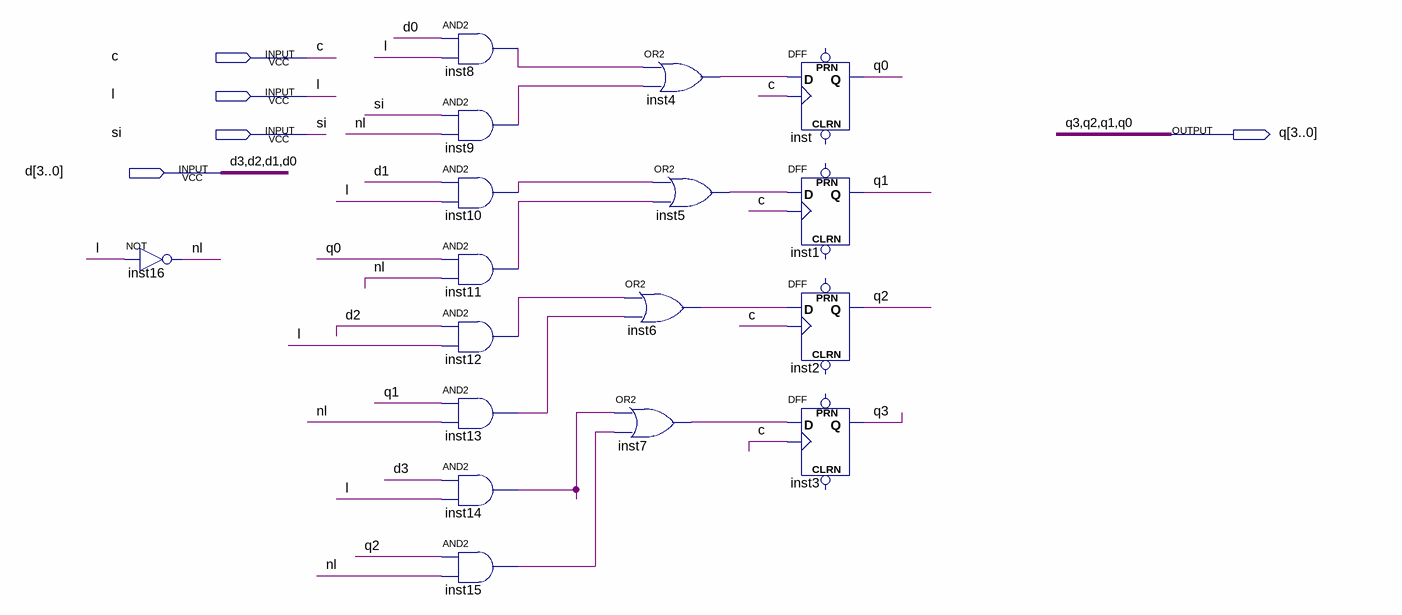
[diagram p0: schematic sheet]
// Quartus schematic s63.bdf as structural Verilog: 17 symbols, 5 pins
module s63 (
  input  c,
  input  l,
  input  si,
  input  [3:0] d,
  output [3:0] q
);

  wire inst4_out, inst5_out, inst6_out, inst7_out, inst8_out, inst9_out, inst10_out, inst11_out, inst12_out,
       inst13_out, inst14_out, inst15_out, nl;

  not inst16 (nl, l);
  and inst8 (inst8_out, d[0], l);
  and inst9 (inst9_out, si, nl);
  and inst10 (inst10_out, d[1], l);
  and inst11 (inst11_out, q[0], nl);
  and inst12 (inst12_out, d[2], l);
  and inst13 (inst13_out, q[1], nl);
  and inst14 (inst14_out, d[3], l);
  and inst15 (inst15_out, q[2], nl);
  or inst4 (inst4_out, inst8_out, inst9_out);
  or inst5 (inst5_out, inst10_out, inst11_out);
  or inst6 (inst6_out, inst12_out, inst13_out);
  or inst7 (inst7_out, inst14_out, inst15_out);
  DFF inst (.CLK(c), .D(inst4_out), .Q(q[0]));  // open: CLRN, PRN
  DFF inst1 (.CLK(c), .D(inst5_out), .Q(q[1]));  // open: CLRN, PRN
  DFF inst2 (.CLK(c), .D(inst6_out), .Q(q[2]));  // open: CLRN, PRN
  DFF inst3 (.CLK(c), .D(inst7_out), .Q(q[3]));  // open: CLRN, PRN
endmodule
